# EAGLE design CameraMux4 (EAGLE 7.4.0)
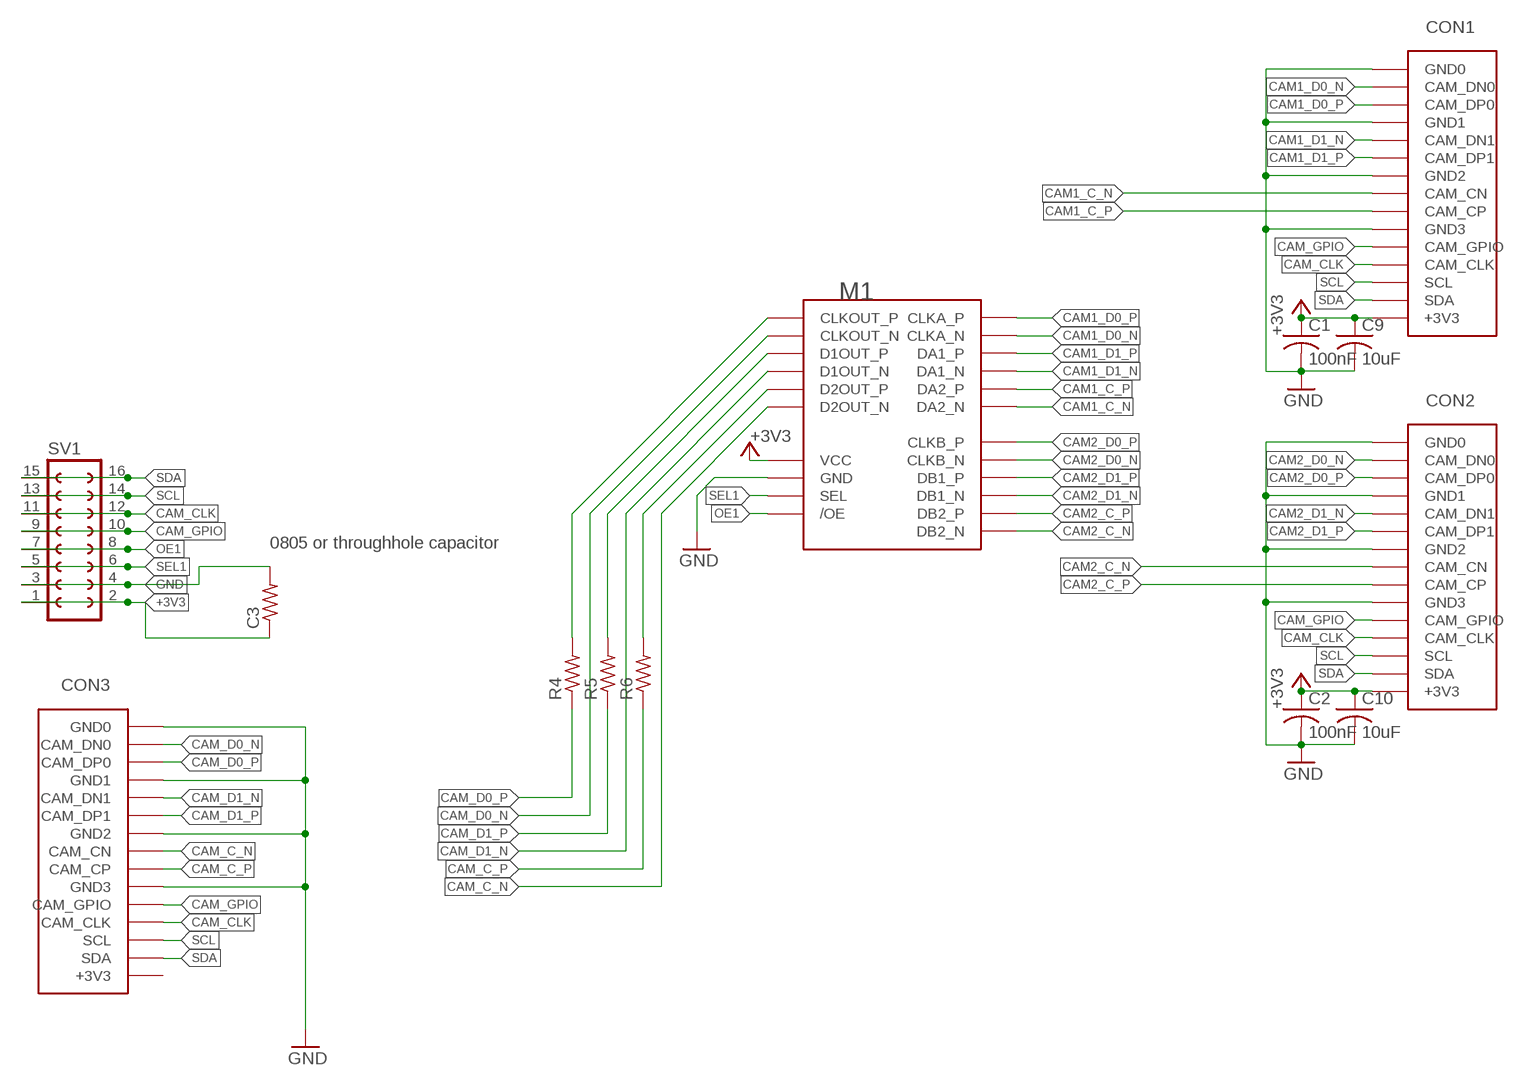
[diagram p0: schematic, sheet 1]

## Parts
C1  100nF  C-USC0603  [C0603]
C2  100nF  C-USC0603  [C0603]
C3  R-US_FLIPFLOP  [0805-THM]
C9  10uF  C-USC0603  [C0603]
C10  10uF  C-USC0603  [C0603]
CON1  XF3M(1)-1515-1B  [XF3M(1)-1515-1B]
CON2  XF3M(1)-1515-1B  [XF3M(1)-1515-1B]
CON3  XF3M(1)-1515-1B  [XF3M(1)-1515-1B]
M1  FSA642  [FSA642]
R4  R-US_R0603  [R0603]
R5  R-US_R0603  [R0603]
R6  R-US_R0603  [R0603]
SV1  FE08-2  [FE08-2]

## Nets
+3V3: C1.1 C2.1 C3.1 C9.1 C10.1 CON1.3V3(+3V3) CON2.3V3(+3V3) M1.VCC SV1.1 SV1.2
CAM1_C_N: CON1.CAM_CN M1.DA2N(DA2_N)
CAM1_C_P: CON1.CAM_CP M1.DA2P(DA2_P)
CAM1_D0_N: CON1.CAM_DN0 M1.CLKAN(CLKA_N)
CAM1_D0_P: CON1.CAM_DP0 M1.CLKAP(CLKA_P)
CAM1_D1_N: CON1.CAM_DN1 M1.DA1N(DA1_N)
CAM1_D1_P: CON1.CAM_DP1 M1.DA1P(DA1_P)
CAM2_C_N: CON2.CAM_CN M1.DB2N(DB2_N)
CAM2_C_P: CON2.CAM_CP M1.DB2P(DB2_P)
CAM2_D0_N: CON2.CAM_DN0 M1.CLKBN(CLKB_N)
CAM2_D0_P: CON2.CAM_DP0 M1.CLKBP(CLKB_P)
CAM2_D1_N: CON2.CAM_DN1 M1.DB1N(DB1_N)
CAM2_D1_P: CON2.CAM_DP1 M1.DB1P(DB1_P)
CAM_C_N: CON3.CAM_CN M1.D2N(D2OUT_N)
CAM_C_P: CON3.CAM_CP R6.1
CAM_CLK: CON1.CAM_CLK CON2.CAM_CLK CON3.CAM_CLK SV1.11 SV1.12
CAM_D0_N: CON3.CAM_DN0 M1.CLKN(CLKOUT_N)
CAM_D0_P: CON3.CAM_DP0 R4.1
CAM_D1_N: CON3.CAM_DN1 M1.D1N(D1OUT_N)
CAM_D1_P: CON3.CAM_DP1 R5.1
CAM_GPIO: CON1.CAM_GPIO CON2.CAM_GPIO CON3.CAM_GPIO SV1.9 SV1.10
GND: C1.2 C2.2 C3.2 C9.2 C10.2 CON1.GND0 CON1.GND1 CON1.GND2 CON1.GND3 CON2.GND0 CON2.GND1 CON2.GND2 CON2.GND3 CON3.GND0 CON3.GND1 CON3.GND2 CON3.GND3 M1.GND SV1.3 SV1.4
N$2: M1.D2P(D2OUT_P) R6.2
N$3: M1.D1P(D1OUT_P) R5.2
N$4: M1.CLKP(CLKOUT_P) R4.2
OE1: M1./OE SV1.7 SV1.8
SCL: CON1.SCL CON2.SCL CON3.SCL SV1.13 SV1.14
SDA: CON1.SDA CON2.SDA CON3.SDA SV1.15 SV1.16
SEL1: M1.SEL SV1.5 SV1.6
Unconnected: CON3.3V3(+3V3)

## Notes on the sheet
- 0805 or throughhole capacitor

## Library data of the parts
C1 C2 C9 C10 = adafruit:C-US: CAPACITOR, American symbol
C3 R4-R6 = adafruit:R-US_: RESISTOR, American symbol
CON1-CON3 = MSGC:XF3M(1)-1515-1B
M1 = MSGC:FSA642
SV1 = con-lsta:FE08-2: FEMALE HEADER; OC_FARNELL: unknown; OC_NEWARK: unknown

## Board
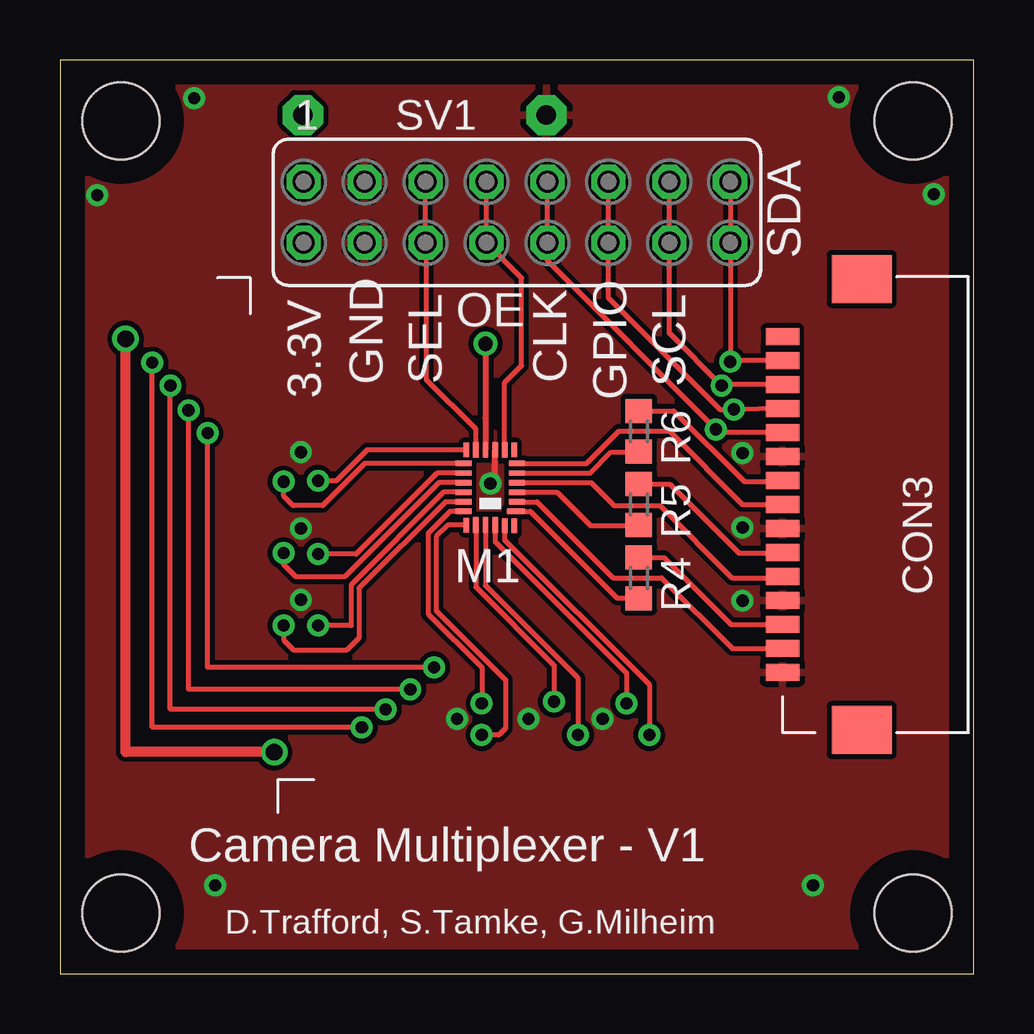
[diagram p1: board, top side]
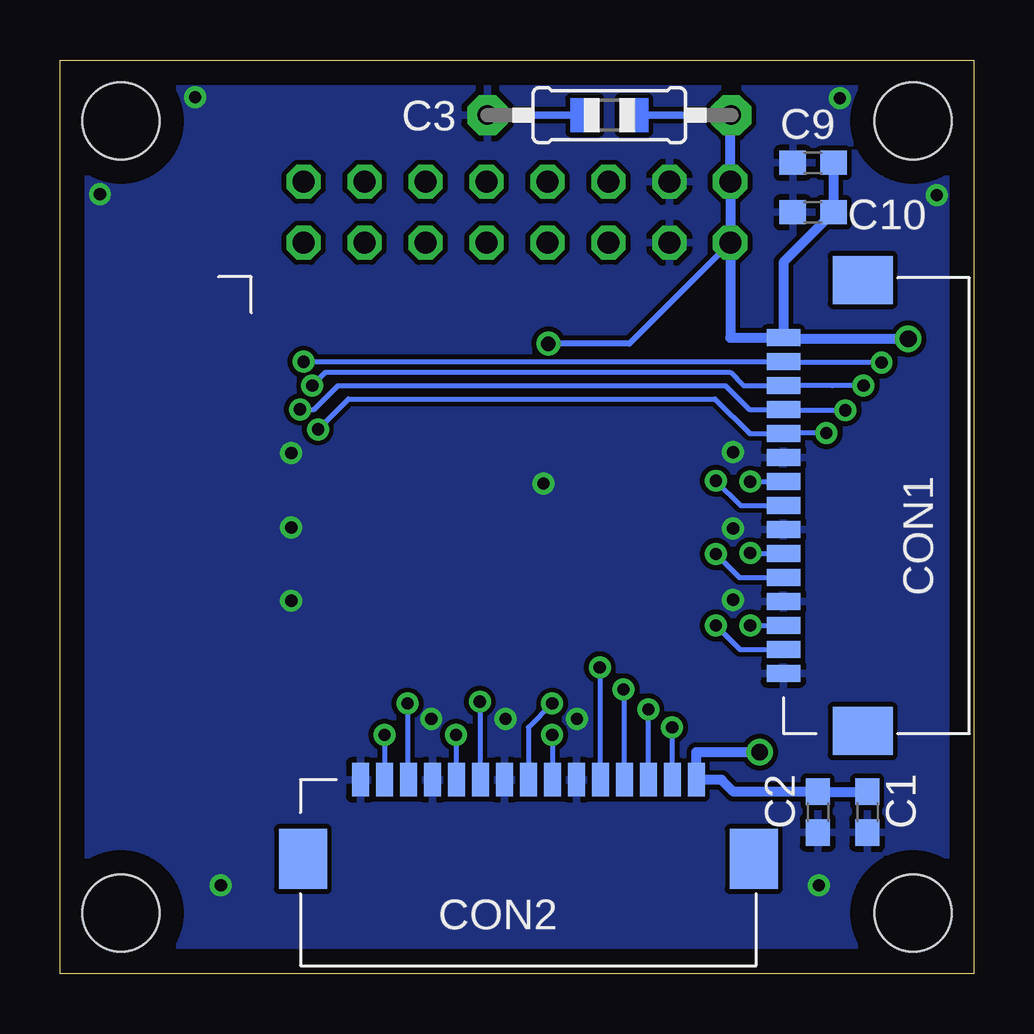
[diagram p2: board, bottom side, seen from below]

Size 38.1 x 38.1 mm. Coordinates in mm from the lower left corner, seen from the top.
Outline: 0,0 38.1,0 38.1,38.1 0,38.1 0,0
Copper layers (1*16): Top 0.035mm / dielectric 1.5mm / Bottom 0.035mm
Design rules "default *": minimum track width 8mil, minimum drill 20mil, track to track 8mil, track to pad 8mil, pad to pad 8mil, via to via 8mil, smd to smd 8mil, copper to edge 40mil, drill to drill 8mil, minimum pad ring 10mil, minimum via ring 8mil, stop-mask expansion 4mil, vias tented up to drill 30mil, thermal gap 10mil
Holes 3.2 mm at 2.54,35.56 35.56,35.56 2.54,2.54 35.56,2.54

### Footprints (pad centres in the part's own frame; a part is rotated, then mirrored left to right if it is on the bottom)
C0603 = smd 1.1 x 1: 1 -0.85,0; 2 0.85,0
0805-THM = drill 0.813 pad 1.676 octagon: 1 -5.08,0; 2 5.08,0
XF3M(1)-1515-1B = smd 0.7 x 1.4: 3V3 7,0; CAM_CLK 4,0; CAM_CN 0,0; CAM_CP 1,0; CAM_DN0 -6,0; CAM_DN1 -3,0; CAM_DP0 -5,0; CAM_DP1 -2,0; CAM_GPIO 3,0; GND0 -7,0; GND1 -4,0; GND2 -1,0; GND3 2,0; SCL 5,0; SDA 6,0 | smd 2 x 2.5: P$17 -9.4,-3.3; P$18 9.4,-3.3
FSA642 = smd 0.225 x 0.663: /OE -0.6,-1.569; CLKBP -0.2,1.569; DB1N 0.2,1.569; DB1P 0.6,1.569; GND -0.2,-1.569; SEL 0.6,-1.569; VCC 0.2,-1.569 | smd 0.663 x 0.225: CLKAN 1.119,0.2; CLKAP 1.119,0.6; CLKN -1.119,0.6; D1N -1.119,-0.2; D1P -1.119,0.2; D2N -1.119,-1; D2P -1.119,-0.6; DA1N 1.119,-0.6; DA1P 1.119,-0.2; DA2P 1.119,-1; DB2N 1.119,1 | smd 0.225 x 0.603: CLKBN -0.6,1.599; DA2N 1,-1.569; DB2P 1,1.569; NC1 -1,-1.569; NC2 -1,1.599 | smd 0.763 x 0.225: CLKP -1.069,1
R0603 = smd 1 x 1.1: 1 -0.85,0; 2 0.85,0
FE08-2 = drill 0.914 octagon: 1 -8.89,1.27; 2 -8.89,-1.27; 3 -6.35,1.27; 4 -6.35,-1.27; 5 -3.81,1.27; 6 -3.81,-1.27; 7 -1.27,1.27; 8 -1.27,-1.27; 9 1.27,1.27; 10 1.27,-1.27; 11 3.81,1.27; 12 3.81,-1.27; 13 6.35,1.27; 14 6.35,-1.27; 15 8.89,1.27; 16 8.89,-1.27

### Placement (x,y rotation side)
C1  4.45,6.75 270 bottom
C2  6.51,6.75 270 bottom
C3  15.2,35.8 180 bottom
C9  6.71,33.81 180 bottom
C10  6.71,31.75 180 bottom
CON1  7.94,19.53 90 bottom
CON2  18.57,8.1 0 bottom
CON3  30.12,19.57 90 top
M1  17.94,20.28 180 top
R4  24.13,16.51 270 top
R5  24.13,19.57 270 top
R6  24.13,22.62 270 top
SV1  19.05,31.75 0 top

### Tracks (layer width: path | path; a pad name or v marks a point on that pad's centre or on a via)
+3V3  (via drill 0.6, 0.7)
  Top 0.254: v17.74,26.27 17.74,23.18 M1.VCC
  Top 0.406: v8.93,9.25 2.74,9.25 v2.74,26.47
  Bottom 0.254: SV1.2 14.37,26.27 v17.74,26.27
  Bottom 0.406: 7.79,26.53 CON1.3V3 | CON1.3V3 10.16,26.53 SV1.2 SV1.1 10.16,35.8 C3.1 | v8.93,9.25 11.57,9.25 CON2.3V3 10.52,8.1 10.02,7.6 C2.1 C1.1 | v2.74,26.47 7.94,26.47 CON1.3V3 | C9.1 C10.1 7.94,29.67 CON1.3V3
CAM1_C_N  (via drill 0.51)
  Top 0.203: M1.DA2N 12.8,21.85 11.51,20.56 v10.76,20.56
  Bottom 0.203: v10.76,20.56 9.72,19.53 CON1.CAM_CN
CAM1_C_P  (via drill 0.51)
  Top 0.203: M1.DA2P 12.7,21.28 10.95,19.53 9.72,19.53 9.33,19.92 v9.33,20.52
  Bottom 0.203: v9.33,20.52 v9.32,20.53 CON1.CAM_CP
CAM1_D0_N  (via drill 0.51)
  Top 0.203: M1.CLKAN 16,20.08 12.14,16.22 12.14,14.53 v10.76,14.53
  Bottom 0.203: v10.76,14.53 9.76,13.53 CON1.CAM_DN0
CAM1_D0_P  (via drill 0.51)
  Top 0.203: M1.CLKAP 16.06,19.68 12.47,16.08 12.47,14.02 11.95,13.49 9.76,13.49 9.33,13.93 v9.33,14.53
  Bottom 0.203: v9.33,14.53 CON1.CAM_DP0 | CON1.CAM_DP0
CAM1_D1_N  (via drill 0.51)
  Top 0.203: M1.DA1N 15.73,20.88 12.35,17.5 v10.76,17.5
  Bottom 0.203: v10.76,17.5 9.78,16.53 CON1.CAM_DN1
CAM1_D1_P  (via drill 0.51)
  Top 0.203: M1.DA1P 15.79,20.48 11.86,16.55 9.84,16.55 9.33,17.07 v9.33,17.54
  Bottom 0.203: v9.33,17.54 9.31,17.53 CON1.CAM_DP1
CAM2_C_N  (via drill 0.51)
  Top 0.203: M1.DB2N 16.27,19.28 15.35,18.36 15.35,15.01 17.58,12.78 v17.58,11.27
  Bottom 0.203: v17.58,11.27 18.57,10.28 CON2.CAM_CN
CAM2_C_P  (via drill 0.51)
  Top 0.203: M1.DB2P 16.17,18.71 15.68,18.23 15.68,15.15 18.57,12.26 18.57,10.24 18.3,9.96 v17.58,9.96
  Bottom 0.203: v17.58,9.96 17.57,9.79 CON2.CAM_CP
CAM2_D0_N  (via drill 0.51)
  Top 0.203: M1.CLKBN 18.54,18.09 24.57,12.06 v24.57,9.96
  Bottom 0.203: v24.57,9.96 v24.57,9.95 CON2.CAM_DN0
CAM2_D0_P  (via drill 0.51)
  Top 0.203: M1.CLKBP 18.14,18.02 23.62,12.54 v23.62,11.27 v23.61,11.27
  Bottom 0.203: v23.61,11.27 23.61,8.14 CON2.CAM_DP0
CAM2_D1_N  (via drill 0.51)
  Top 0.203: M1.DB1N 17.74,16.19 21.59,12.34 v21.59,9.96
  Bottom 0.203: v21.59,9.96 21.59,8.11 CON2.CAM_DN1
CAM2_D1_P  (via drill 0.51)
  Top 0.203: M1.DB1P 17.34,16.12 20.6,12.86 v20.6,11.35
  Bottom 0.203: v20.6,11.35 20.6,8.12 CON2.CAM_DP1
CAM_C_N
  Top 0.203: M1.D2N 21.95,21.28 23.3,22.62 25.4,22.62 28.46,19.57 CON3.CAM_CN
CAM_C_P
  Top 0.203: R6.1 25.58,23.47 28.54,20.52 29.56,20.52 CON3.CAM_CP
CAM_CLK  (via drill 0.51)
  Top 0.203: CON3.CAM_CLK 28.15,23.53 v28.1,23.54 27.5,23.54 22.86,28.18 SV1.12 SV1.11 | v14.61,11.87 5.36,11.87 v5.36,23.5
  Bottom 0.203: v28.1,23.54 27.5,23.54 26.51,24.53 10.36,24.53 9.37,23.54 CON1.CAM_CLK 7.94,23.5 v5.36,23.5 | CON2.CAM_CLK 14.57,11.87 v14.61,11.87
CAM_D0_N
  Top 0.203: M1.CLKN 19.89,19.68 23.06,16.51 25.08,16.51 28.03,13.57 CON3.CAM_DN0
CAM_D0_P
  Top 0.203: R4.1 25.18,17.36 27.98,14.57 CON3.CAM_DP0
CAM_D1_N
  Top 0.203: M1.D1N 22.14,20.48 23.1,19.53 25,19.53 28.02,16.51 29.55,16.51 CON3.CAM_DN1
CAM_D1_P
  Top 0.203: R5.1 25.42,20.42 28.3,17.54 29.55,17.54 CON3.CAM_DP1
CAM_GPIO  (via drill 0.51)
  Top 0.203: v15.6,12.78 6.15,12.78 v6.15,22.54 | SV1.9 SV1.10 20.32,29.73 v27.34,22.7 27.48,22.57 CON3.CAM_GPIO
  Bottom 0.203: v27.34,22.7 26.07,23.97 10.79,23.97 9.35,22.53 CON1.CAM_GPIO 7.94,22.54 v6.15,22.54 | CON2.CAM_GPIO 15.57,12.78 v15.6,12.78
GND  (via drill 0.51)
  Top 0.254: v17.94,20.44 18.14,20.64 M1.GND
  other vias: 10.04,21.75 10.04,18.57 10.04,15.6 16.55,10.64 19.53,10.64 22.62,10.64 28.46,15.56 28.46,18.61 28.46,21.71 6.47,3.69 31.39,3.69 1.55,32.46 5.6,36.51 32.46,36.55 36.43,32.5
  pour Bottom: 0,38.1 38.1,38.1 38.1,0 0,0
  pour Top: 0,38.1 38.1,38.1 38.1,0 0,0
N$2
  Top 0.203: M1.D2P 22.11,20.88 22.98,21.75 24.11,21.75 R6.2
N$3
  Top 0.203: M1.D1P 20.72,20.08 22.11,18.69 24.11,18.69 R5.2
N$4
  Top 0.203: M1.CLKP 19.61,19.28 23.22,15.68 24.11,15.68 R4.2
OE1
  Top 0.203: SV1.7 SV1.8 19.25,29.01 19.25,25.36 18.54,24.65 M1./OE
SCL  (via drill 0.51)
  Top 0.203: CON3.SCL 27.62,24.57 v27.58,24.53 25.4,26.71 SV1.14 SV1.13 | v13.57,11.03 4.6,11.03 v4.6,24.53
  Bottom 0.203: v27.58,24.53 27.03,25.08 10.16,25.08 9.6,24.53 CON1.SCL 5.91,24.53 v4.6,24.53 | CON2.SCL v13.57,11.03
SDA  (via drill 0.51)
  Top 0.203: CON3.SDA 27.91,25.57 v27.94,25.52 SV1.16 SV1.15 | v12.58,10.28 3.85,10.28 v3.85,25.48
  Bottom 0.203: v27.94,25.52 7.95,25.52 CON1.SDA 7.94,25.48 v3.85,25.48 | CON2.SDA 12.57,10.32 v12.58,10.28
SEL1
  Top 0.203: SV1.5 SV1.6 15.28,30.44 15.28,24.77 17.34,22.71 M1.SEL

### Text on the board
tNames: SDA | OE | GND | SEL | CLK | 3.3V | GPIO | SCL | Camera Multiplexer - V1 | D.Trafford, S.Tamke, G.Milheim